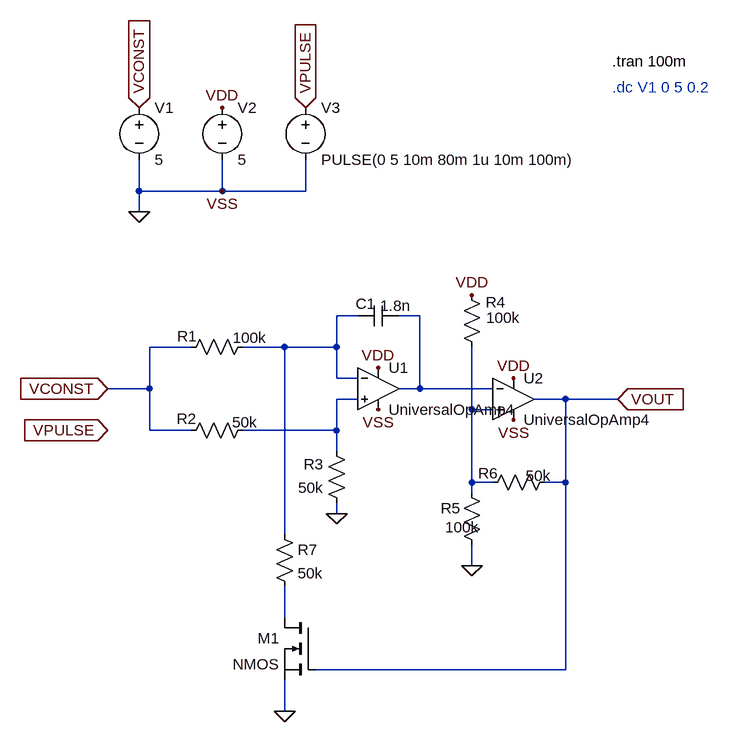
[diagram p0: schematic vco.asc]
vco.asc, the LTspice schematic file:
Version 4
SHEET 1 912 852
WIRE -144 32 -144 -16
WIRE -16 32 -16 -16
WIRE -16 32 -144 32
WIRE 112 32 112 -16
WIRE 112 32 -16 32
WIRE -144 64 -144 32
WIRE 192 224 160 224
WIRE 288 224 256 224
WIRE -64 272 -128 272
WIRE 80 272 16 272
WIRE 160 272 160 224
WIRE 160 272 80 272
WIRE 160 320 160 272
WIRE 192 320 160 320
WIRE -128 336 -128 272
WIRE -128 336 -192 336
WIRE 288 336 288 224
WIRE 288 336 256 336
WIRE 400 336 288 336
WIRE 192 352 160 352
WIRE 512 352 464 352
WIRE 592 352 512 352
WIRE 368 368 368 272
WIRE 400 368 368 368
WIRE -128 400 -128 336
WIRE -64 400 -128 400
WIRE 160 400 160 352
WIRE 160 400 16 400
WIRE 160 432 160 400
WIRE 368 480 368 368
WIRE 400 480 368 480
WIRE 512 480 512 352
WIRE 512 480 480 480
WIRE 368 496 368 480
WIRE 160 528 160 512
WIRE 80 560 80 272
WIRE 368 608 368 576
WIRE 80 688 80 640
WIRE 512 768 512 480
WIRE 512 768 128 768
WIRE 80 832 80 784
FLAG 224 304 VDD
FLAG 224 368 VSS
FLAG 432 320 VDD
FLAG 432 384 VSS
FLAG 160 528 0
FLAG 368 608 0
FLAG 368 192 VDD
FLAG 80 832 0
FLAG 592 352 VOUT
IOPIN 592 352 In
FLAG -16 -96 VDD
FLAG -16 32 VSS
FLAG -144 64 0
FLAG -144 -96 VCONST
IOPIN -144 -96 In
FLAG 112 -96 VPULSE
IOPIN 112 -96 In
FLAG -192 400 VPULSE
IOPIN -192 400 In
FLAG -192 336 VCONST
IOPIN -192 336 In
SYMBOL OpAmps\\UniversalOpAmp4 224 336 R0
SYMATTR InstName U1
SYMBOL OpAmps\\UniversalOpAmp4 432 352 R0
SYMATTR InstName U2
SYMBOL res 32 256 R90
WINDOW 0 15 102 VBottom 2
WINDOW 3 -14 6 VTop 2
SYMATTR InstName R1
SYMATTR Value 100k
SYMBOL res 32 384 R90
WINDOW 0 14 103 VBottom 2
WINDOW 3 -12 13 VTop 2
SYMATTR InstName R2
SYMATTR Value 50k
SYMBOL res 176 528 R180
WINDOW 0 36 76 Left 2
WINDOW 3 36 40 Left 2
SYMATTR InstName R3
SYMATTR Value 50k
SYMBOL cap 256 208 R90
WINDOW 0 13 51 VBottom 2
WINDOW 3 -15 5 VTop 2
SYMATTR InstName C1
SYMATTR Value 1.8n
SYMBOL res 352 176 R0
WINDOW 0 37 27 Left 2
WINDOW 3 38 51 Left 2
SYMATTR InstName R4
SYMATTR Value 100k
SYMBOL res 352 480 R0
WINDOW 0 -32 40 Left 2
WINDOW 3 -25 69 Left 2
SYMATTR InstName R5
SYMATTR Value 100k
SYMBOL res 496 464 R90
WINDOW 0 18 103 VBottom 2
WINDOW 3 -10 26 VTop 2
SYMATTR InstName R6
SYMATTR Value 50k
SYMBOL res 64 544 R0
SYMATTR InstName R7
SYMATTR Value 50k
SYMBOL voltage -144 -112 R0
WINDOW 123 0 0 Left 0
WINDOW 39 0 0 Left 0
SYMATTR InstName V1
SYMATTR Value 5
SYMBOL voltage -16 -112 R0
WINDOW 123 0 0 Left 0
WINDOW 39 0 0 Left 0
SYMATTR InstName V2
SYMATTR Value 5
SYMBOL nmos 128 688 M0
SYMATTR InstName M1
SYMBOL voltage 112 -112 R0
WINDOW 123 0 0 Left 0
WINDOW 39 0 0 Left 0
SYMATTR InstName V3
SYMATTR Value PULSE(0 5 10m 80m 1u 10m 100m)
TEXT 584 -168 Left 2 !.tran 100m
TEXT 584 -128 Left 2 ;.dc V1 0 5 0.2

The netlist it stands for:
* vco.asc
* U1: UniversalOpAmp4 (symbol OpAmps\UniversalOpAmp4 not available, pins judged from their places): In+=N003 In-=N001 V+=VDD V-=0 OUT=N002
* U2: UniversalOpAmp4 (symbol OpAmps\UniversalOpAmp4 not available, pins judged from their places): In+=N004 In-=N002 V+=VDD V-=0 OUT=VOUT
R1 N001 VCONST 100k
R2 N003 VCONST 50k
R3 0 N003 50k
C1 N002 N001 1.8n
R4 VDD N004 100k
R5 N004 0 100k
R6 VOUT N004 50k
R7 N001 N005 50k
V1 VCONST 0 5
V2 VDD 0 5
M1 N005 VOUT 0 0 NMOS
V3 VPULSE 0 PULSE(0 5 10m 80m 1u 10m 100m)
.model NMOS NMOS
.model PMOS PMOS
.lib standard.mos
.tran 100m
* .dc V1 0 5 0.2
.backanno
.end